# Altium schematic sheet Title Block.SchDoc: Title Block
size A3; Author: Silard Gal; SheetNumber: 1; SheetTotal: 7
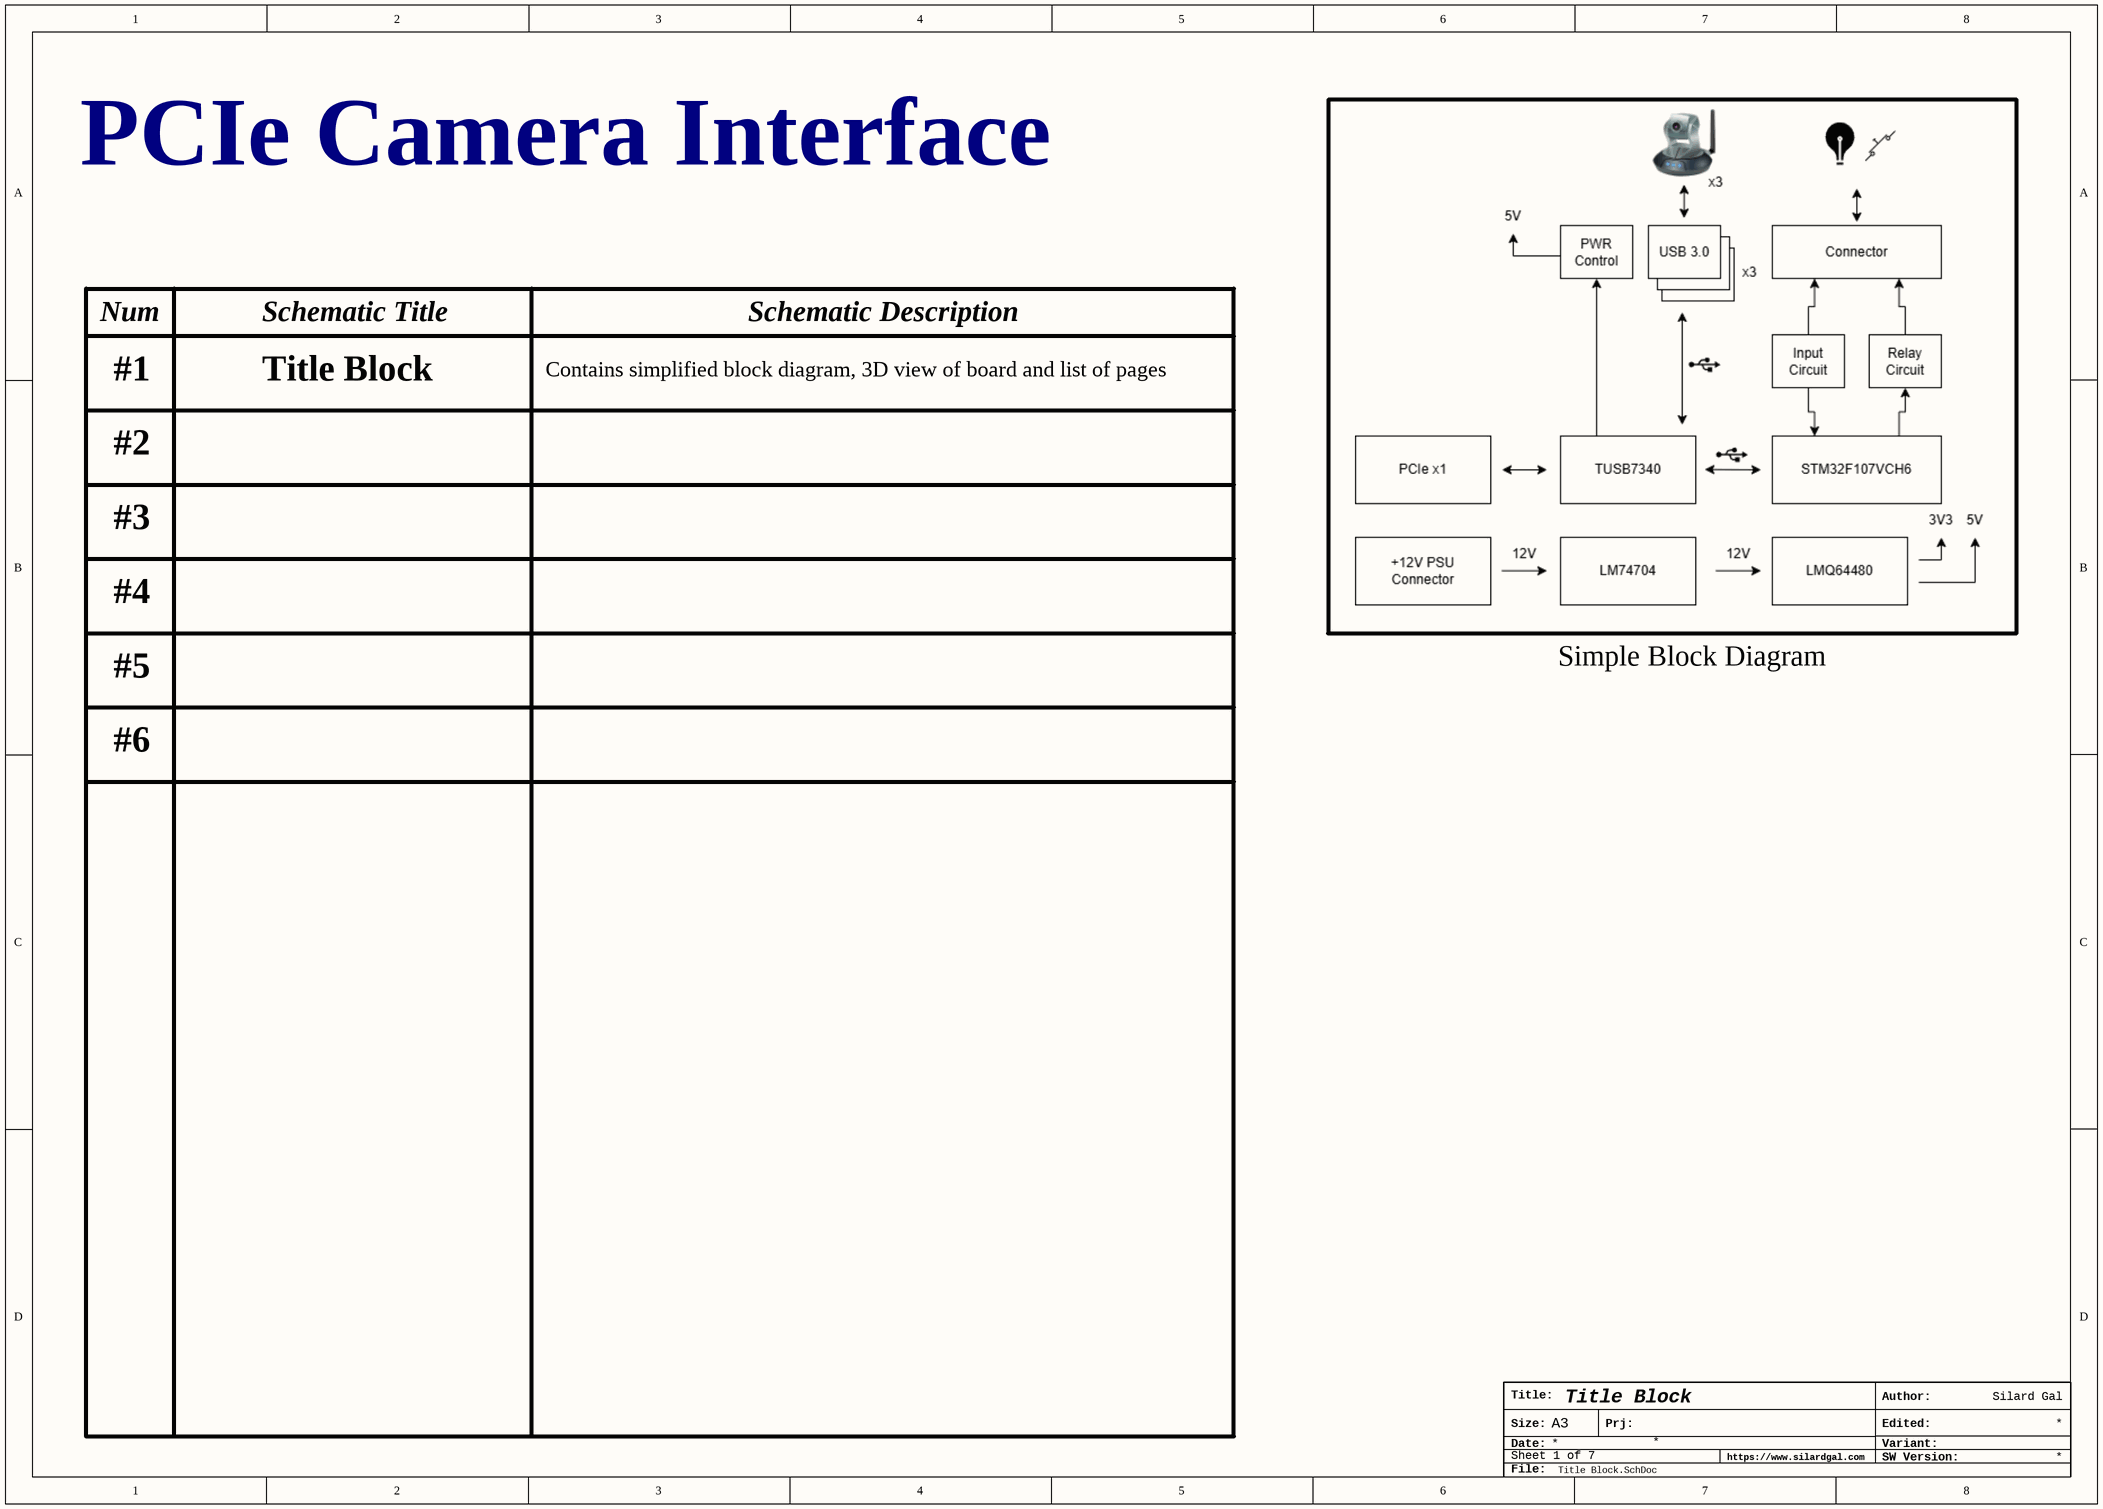
[diagram p0: Title Block.SchDoc]

## Notes on the sheet
- PCIe Camera Interface
- Num
- Schematic Title
- Contains simplified block diagram, 3D view of board and list of pages
- Schematic Description
- #1
- Title Block
- #2
- #3
- #4
- #5
- Simple Block Diagram
- #6
- Title:
- Author:
- Size:
- Date:
- A3
- Prj:
- https://www.silardgal.com
- SW Version:
- Variant:
- Edited:
- File: